# Altium schematic sheet HW_V4.1.SchDoc
size 330 x 241 mm
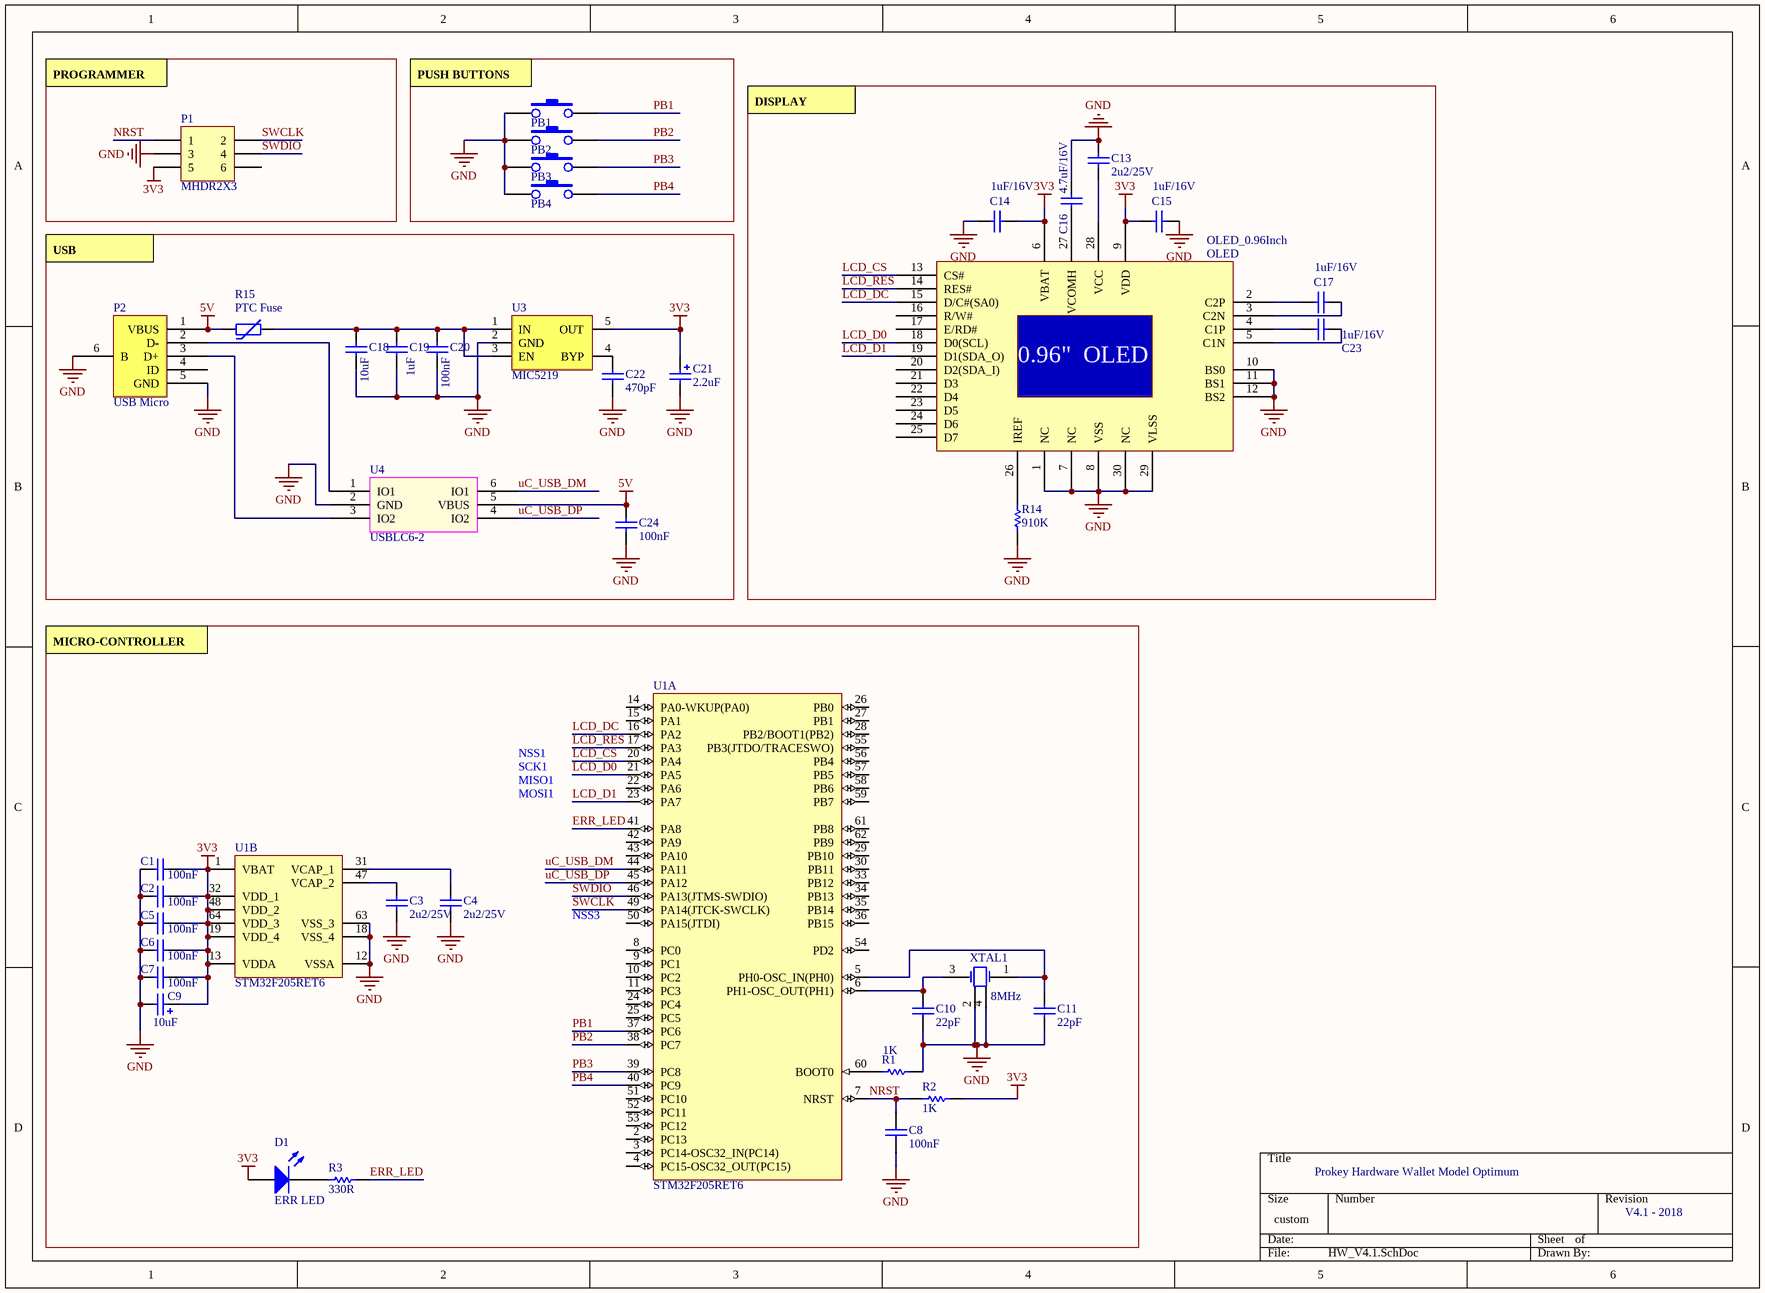
[diagram p0: HW_V4.1.SchDoc]

## Parts
C1  100nF  [0603]
C2  100nF  [0603]
C3  2u2/25V  [0805]
C4  2u2/25V  [0805]
C5  100nF  [0603]
C6  100nF  [0603]
C7  100nF  [0603]
C8  100nF  [0603]
C9  10uF  [3216P]
C10  22pF  [0603]
C11  22pF  [0603]
C13  2u2/25V  [0805]
C14  1uF/16V  [0805]
C15  1uF/16V  [0805]
C16  4.7uF/16V  [0805]
C17  1uF/16V  [0805]
C18  10uF  [0805]
C19  1uF  [0805]
C20  100nF  [0603]
C21  2.2uF  [3216P]
C22  470pF  [0603]
C23  1uF/16V  [0805]
C24  100nF  [0603]
D1  ERR LED  [d805]
OLED  OLED_0.96Inch  [OLED_0.96]
P1  MHDR2X3  [MHDR2X3]
P2  USB Micro  [USB_MICRO]
PB1  PUSH BUTTON  [TACTIC_SW_3.7_3.7_0.35]  (value not drawn)
PB2  PUSH BUTTON  [TACTIC_SW_3.7_3.7_0.35]  (value not drawn)
PB3  PUSH BUTTON  [TACTIC_SW_3.7_3.7_0.35]  (value not drawn)
PB4  PUSH BUTTON  [TACTIC_SW_3.7_3.7_0.35]  (value not drawn)
R1  1K  [0603]
R2  1K  [0603]
R3  330R  [0603]
R14  910K  [0603]
R15  PTC Fuse  [NTC 0805/2012]
U1  STM32F205RET6  [STM-LQFP64_N]  (parts A,B of 2)
U3  MIC5219  [SOT-23-5]
U4  USBLC6-2  [SOT-666]
XTAL1  8MHz  [XTAL_XYC]

## Nets
3V3: C1.2 C2.2 C5.2 C6.2 C7.2 C9.1 C14.2 C15.1 C21.1 D1.1(A) OLED.6(VBAT) OLED.9(VDD) P1.5 R2.2 U1.1(VBAT) U1.13(VDDA) U1.19(VDD_4) U1.32(VDD_1) U1.48(VDD_2) U1.64(VDD_3) U3.5(OUT)
5V: C24.1 P2.1(VBUS) R15.1 U4.5(VBUS)
GND: C1.1 C2.1 C3.1 C4.1 C5.1 C6.1 C7.1 C8.2 C9.2 C10.1 C11.1 C13.2 C14.1 C15.2 C16.2 C18.1 C19.1 C20.1 C21.2 C22.1 C24.2 OLED.1(NC) OLED.7(NC) OLED.8(VSS) OLED.10(BS0) OLED.11(BS1) OLED.12(BS2) OLED.29(VLSS) OLED.30(NC) P1.3 P2.5(GND) P2.6(B) PB1.1 PB2.1 PB3.1 PB4.1 R1.2 R14.1 U1.12(VSSA) U1.18(VSS_4) U1.63(VSS_3) U3.2(GND) U4.2(GND) XTAL1.2 XTAL1.4
ERR_LED: R3.2 U1.41(PA8)
LCD_CS: OLED.13(CS#) U1.20(PA4)
LCD_D0: OLED.18(D0(SCL)) U1.21(PA5)
LCD_D1: OLED.19(D1(SDA_O)) U1.23(PA7)
LCD_DC: OLED.15(D/C#(SA0)) U1.16(PA2)
LCD_RES: OLED.14(RES#) U1.17(PA3)
NRST: C8.1 P1.1 R2.1 U1.7(NRST)
PB1: PB1.2 U1.37(PC6)
PB2: PB2.2 U1.38(PC7)
PB3: PB3.2 U1.39(PC8)
PB4: PB4.2 U1.40(PC9)
SWCLK: P1.2 U1.49(PA14(JTCK-SWCLK))
SWDIO: P1.4 U1.46(PA13(JTMS-SWDIO))
uC_USB_DM: U1.44(PA11) U4.6(IO1)
uC_USB_DP: U1.45(PA12) U4.4(IO2)
NetC3_2: C3.2 U1.47(VCAP_2)
NetC4_2: C4.2 U1.31(VCAP_1)
NetC10_2: C10.2 U1.6(PH1-OSC_OUT(PH1)) XTAL1.3(OSC2)
NetC11_2: C11.2 U1.5(PH0-OSC_IN(PH0)) XTAL1.1(OSC1)
NetC13_1: C13.1 OLED.28(VCC)
NetC16_1: C16.1 OLED.27(VCOMH)
NetC17_1: C17.1 OLED.2(C2P)
NetC17_2: C17.2 OLED.3(C2N)
NetC18_2: C18.2 C19.2 C20.2 R15.2 U3.1(IN) U3.3(EN)
NetC22_2: C22.2 U3.4(BYP)
NetC23_1: C23.1 OLED.4(C1P)
NetC23_2: C23.2 OLED.5(C1N)
NetD1_2: D1.2(K) R3.1
NetOLED_26: OLED.26(IREF) R14.2
NetP2_2: P2.2(D-) U4.1(IO1)
NetP2_3: P2.3(D+) U4.3(IO2)
NetR1_1: R1.1 U1.60(BOOT0)

Not connected (* = marked no-connect by the designer): OLED 16(R/W#) 17(E/RD#) 20(D2(SDA_I)) 21(D3) 22(D4) 23(D5) 24(D6) 25(D7); P1 6; P2 4(ID); U1 2(PC13) 3(PC14-OSC32_IN(PC14)) 4(PC15-OSC32_OUT(PC15)) 8(PC0) 9(PC1) 10(PC2) 11(PC3) 14(PA0-WKUP(PA0)) 15(PA1) 22(PA6) 24(PC4) 25(PC5) 26(PB0) 27(PB1) 28(PB2/BOOT1(PB2)) 29(PB10) 30(PB11) 33(PB12) 34(PB13) 35(PB14) 36(PB15) 42(PA9) 43(PA10) 50(PA15(JTDI)) 51(PC10) 52(PC11) 53(PC12) 54(PD2) 55(PB3(JTDO/TRACESWO)) 56(PB4) 57(PB5) 58(PB6) 59(PB7) 61(PB8) 62(PB9)

## Notes on the sheet
- PROGRAMMER
- (near PB1) PUSH BUTTONS
- DISPLAY
- USB
- MICRO-CONTROLLER
- NSS1
- SCK1
- MISO1
- MOSI1
- NSS3
- Prokey Hardware Wallet Model Optimum
- V4.1 - 2018
- (in symbol OLED_0.96) 0.96"  OLED

## Library data of the parts
C1 C2 C5-C8 C10 C11 C22 = CAP: Capacitor
C3 C4 C13-C19 C23 = Cap Semi: Capacitor (Semiconductor SIM Model); Value: 100nF; Published: 8-Jun-2000; LatestRevisionDate: 17-Jul-2002; LatestRevisionNote: Re-released for DXP Platform.; PackageReference: C1206; Publisher: Altium Limited
C9 C21 = Cap Pol3: Polarized Capacitor (Surface Mount); Value: 1uF; Published: 8-Jun-2000; LatestRevisionDate: 17-Jul-2002; LatestRevisionNote: Re-released for DXP Platform.; PackageReference: C0805; Publisher: Altium Limited
C20 C24 = Cap Semi: Capacitor (Semiconductor SIM Model); Published: 8-Jun-2000; LatestRevisionDate: 17-Jul-2002; LatestRevisionNote: Re-released for DXP Platform.; PackageReference: C1206; Publisher: Altium Limited; Value: 100nF
D1 = LED SMD: Typical BLUE SiC LED; Published: 8-Jun-2000; LatestRevisionDate: 17-Dec-2003; LatestRevisionNote: PCB Footprint replaced.; DatasheetVersion: 16-Apr-2002; PackageVersion: 16-Apr-2002; PackageReference: 3.5X2.8X1.9; Publisher: Altium Limited; PackageDescription: SM LED; 2 C-Bend Leads; Body 3.5 x 2.8 x 1.9 mm, inc leads (LxWxH typ)
OLED = OLED_0.96
P1 = MHDR2X3: Header, 3-Pin, Dual row; LatestRevisionDate: 17-Jul-2002; LatestRevisionNote: Re-released for DXP Platform.; Publisher: Altium Limited
R1 R2 = RES: Resisor
R3 R14 = Res Semi: Semiconductor Resistor; Value: 1K
R15 = Thermistor: SMT Resistor; Manufactur: LittleFuse; Manufacture PN: 0805L035; Value: PTC Fuse
U1 = STM32F205RET6: ARM Cortex-M3 32-bit MCU, 512 KB Flash, 128 KB Internal RAM, 51 I/Os, 64-pin LQFP, -40 to 85 degC, Tray; D/A Converter: 2x12-bit (2 Channel); FLASH Size (Prog) (kB): 512; I/Os (High Current): 51; Internal RAM Size (kB): 128; Operating Frequency(F) (Processor speed) (MHz): 120; Supply Voltage(Vcc) min (V): 1.8; DatasheetVersion: Rev. 9; PackageVersion: Rev. 4, 06/2013; PackageReference: LQFP64; PackageDescription: 64-Pin Low Profile Quad Flat Package, 10 x 10 mm Body, 0.5 mm Pitch; Supplier 1: Digi-Key; Supplier Part Number 1: 497-11155-ND; Supplier 2: Farnell; Supplier Part Number 2: 2060897; Supplier 3: Newark; Supplier Part Number 3: 47T9329; Supplier 4: Mouser; Supplier Part Number 4: 511-STM32F205RET6; Core: ARM Cortex-M3; Packing: Tray; Mounting Technology: Surface Mount; PartNumber: STM32F205RET6; ComponentLink1Description: Manufacturer URL; ComponentLink1URL: http://www.st.com/web/en/home.html; ComponentLink2Description: Datasheet; ComponentLink2URL: http://www.st.com/st-web-ui/static/active/en/resource/technical/document/datasheet/CD00237391.pdf; ComponentLink3Description: Package Specification; ComponentLink3URL: http://www.st.com/st-web-ui/static/active/en/resource/technical/document/datasheet/DM00037051.pdf
U3 = MIC5219-3.3BM5
XTAL1 = XTAL_XYC